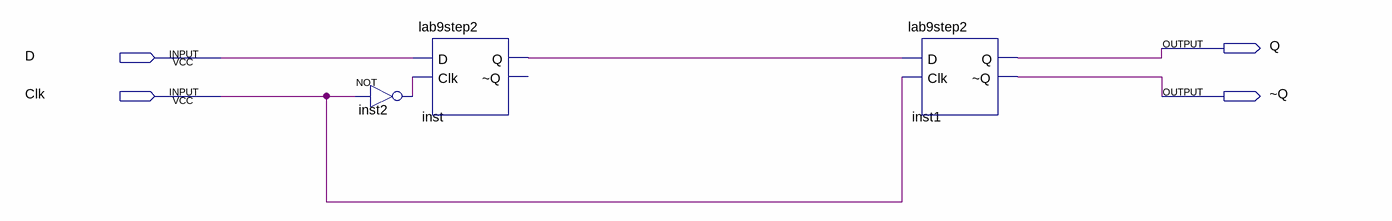
[diagram p0: schematic sheet]
// Quartus schematic lab9step3b.bdf as structural Verilog: 3 symbols, 4 pins
module lab9step3b (
  input  D,
  input  Clk,
  output Q,
  output \~Q 
);

  wire inst2_out, inst_q;

  not inst2 (inst2_out, Clk);
  lab9step2 inst (.D(D), .Clk(inst2_out), .Q(inst_q));  // open: ~Q
  lab9step2 inst1 (.D(inst_q), .Clk(Clk), .Q(Q), .\~Q (\~Q ));
endmodule
